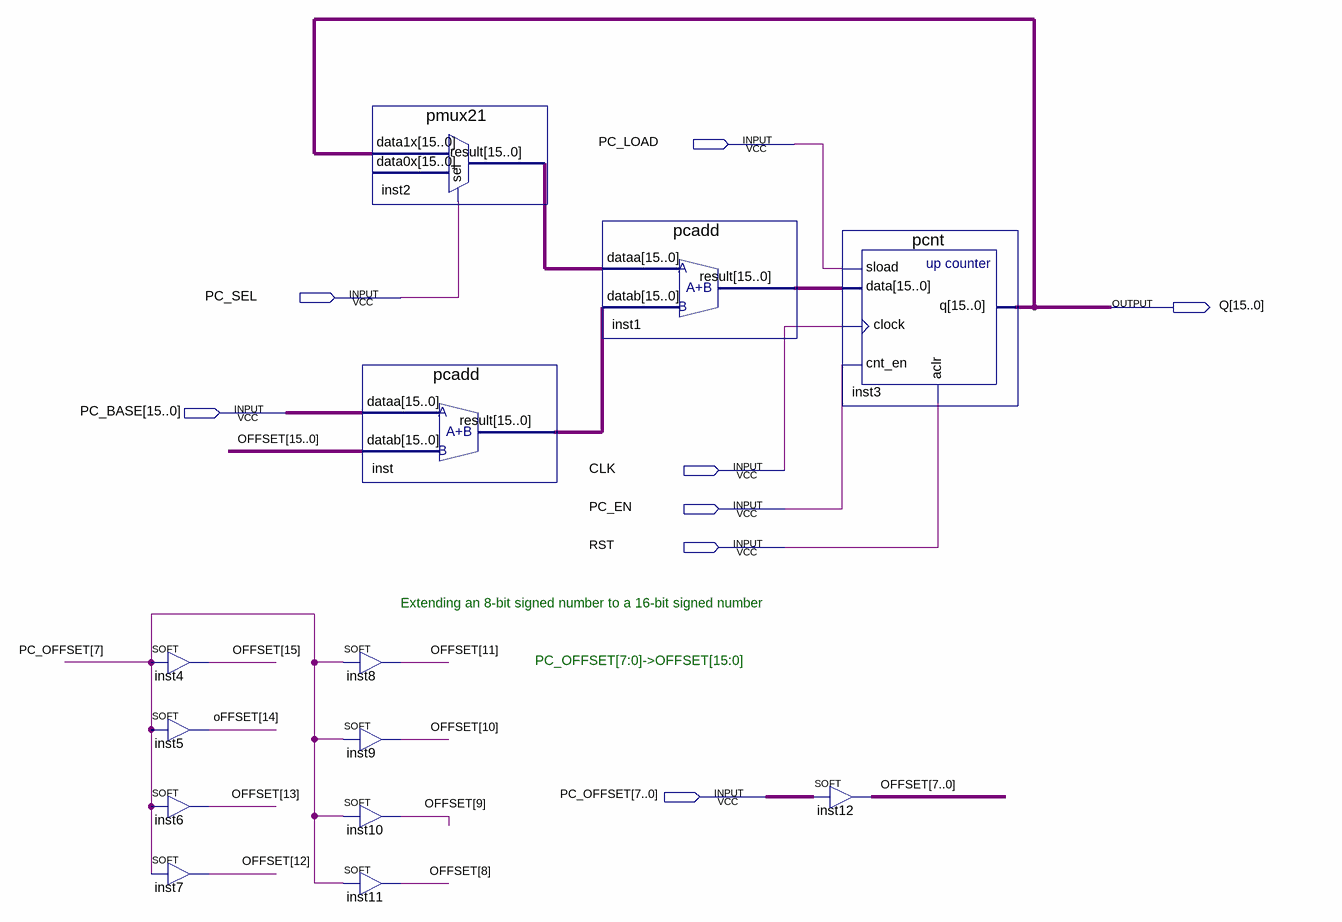
[diagram p0: schematic sheet]
// Quartus schematic lab505PCcnt.bdf as structural Verilog: 13 symbols, 8 pins
module lab505PCcnt (
  input  PC_LOAD,
  input  PC_SEL,
  input  [15:0] PC_BASE,
  input  CLK,
  input  PC_EN,
  input  RST,
  input  [7:0] PC_OFFSET,
  output [15:0] Q
);

  wire [15:0] inst1_result, inst2_result, inst_result, OFFSET;

  SOFT inst4 (.IN(PC_OFFSET[7]), .OUT(OFFSET[15]));
  SOFT inst5 (.IN(PC_OFFSET[7]), .OUT(OFFSET[14]));
  SOFT inst6 (.IN(PC_OFFSET[7]), .OUT(OFFSET[13]));
  SOFT inst7 (.IN(PC_OFFSET[7]), .OUT(OFFSET[12]));
  pcadd inst (.dataa(PC_BASE), .datab(OFFSET), .result(inst_result));
  SOFT inst8 (.IN(PC_OFFSET[7]), .OUT(OFFSET[11]));
  SOFT inst9 (.IN(PC_OFFSET[7]), .OUT(OFFSET[10]));
  SOFT inst10 (.IN(PC_OFFSET[7]), .OUT(OFFSET[9]));
  SOFT inst11 (.IN(PC_OFFSET[7]), .OUT(OFFSET[8]));
  pmux21 inst2 (.data1x(Q), .sel(PC_SEL), .result(inst2_result));  // open: data0x
  pcadd inst1 (.dataa(inst2_result), .datab(inst_result), .result(inst1_result));
  SOFT inst12[7:0] (.IN(PC_OFFSET), .OUT(OFFSET[7:0]));
  pcnt inst3 (.sload(PC_LOAD), .data(inst1_result), .clock(CLK), .cnt_en(PC_EN), .aclr(RST), .q(Q));

  // Notes on the sheet:
  //   Extending an 8-bit signed number to a 16-bit signed number
  //   PC_OFFSET[7:0]->OFFSET[15:0]
endmodule
